# Altium schematic sheet User_Terminal_Block.SchDoc
size A4; SheetNumber: 3; SheetTotal: 4
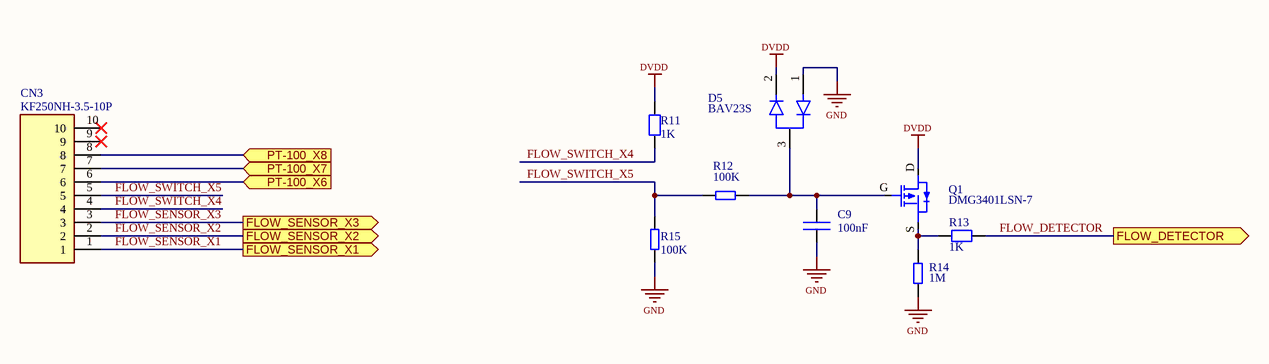
[diagram p0: User_Terminal_Block.SchDoc]

## Parts
C9  100nF  [CAP_SM0603_YAGEOCC2_N]
CN3  KF250NH-3.5-10P  [KF250NH-3.5-10P]
D5  BAV23S  [BAV23S]
Q1  DMG3401LSN-7  [DMG3401LSN-7]
R11  1K  [RES_SM0603_YAGEORC_N]
R12  100K  [RES_SM0603_YAGEORC_N]
R13  1K  [RES_SM0603_YAGEORC_N]
R14  1M  [RES_SM0603_YAGEORC_N]
R15  100K  [RES_SM0603_YAGEORC_N]

## Ports
FLOW_DETECTOR (out), FLOW_SENSOR_X1 (out), FLOW_SENSOR_X2 (out), FLOW_SENSOR_X3 (out), PT-100_X6 (in), PT-100_X7 (in), PT-100_X8 (in)

## Nets
DVDD: D5.2 Q1.D R11.2
GND: C9.2 D5.1 R14.1 R15.1
FLOW_DETECTOR: R13.2 ; port FLOW_DETECTOR
FLOW_SENSOR_X1: CN3.1 ; port FLOW_SENSOR_X1
FLOW_SENSOR_X2: CN3.2 ; port FLOW_SENSOR_X2
FLOW_SENSOR_X3: CN3.3 ; port FLOW_SENSOR_X3
FLOW_SWITCH_X4: CN3.4 R11.1
FLOW_SWITCH_X5: CN3.5 R12.1 R15.2
PT-100_X6: CN3.6 ; port PT-100_X6
PT-100_X7: CN3.7 ; port PT-100_X7
PT-100_X8: CN3.8 ; port PT-100_X8
NetC9_1: C9.1 D5.3 Q1.G R12.2
NetQ1_S: Q1.S R13.1 R14.2

Not connected (* = marked no-connect by the designer): CN3 9* 10*

## Library data of the parts
C9 = CC0603KRX7R9BB104: CAP 100nF SM0603 X7R 50V YAGEO CC2; Tolerance (%): 10; Voltage Rating (Volts): 50; Category: Capacitor; Manufacturer: Yageo; Manufacturer Part Number: CC0603KRX7R9BB104; Package: 0603; Value: 100nF; Supplier Part Number 1: 1362556; Supplier 1: Farnell; ComponentLink1URL: http://www.yageo.com; ComponentLink1Description: Manufacturer Website; Supplier 2: Digi-Key; Supplier Part Number 2: 311-1344-1-ND; Datasheet: https://datasheet.lcsc.com/lcsc/2211101700_YAGEO-CC0603KRX7R9BB104_C14663.pdf
CN3 = KF250NH-3.5-10P: PCB Terminal Block 1752188; Manufacturer: cixi_kefa_elec; Vendor Part Number: C976564; Vendor: LCSC; Manufacturer Part Number: KF250NH-3.5-10P; Price: 1.22
D5 = BAV23S: DIODE ARRAY GP 250V 200MA SOT23; Manufacturer: onsemi; Manufacturer Part Number: BAV23S; Category: Diodo; Datasheet: https://www.onsemi.com/pdf/datasheet/bav23s-d.pdf; Temperature Max: 150; Temperature Min: -55
Q1 = DMG3401LSN-7: P-CHANNEL ENHANCEMENT MODE MOSFET / RDS(ON) = 85mΩ @ VGS = -2.5V -> ID -2.7A / V(BR)DDS 30V; Manufacturer: Diodes Incorporated; Category: Transistor mosfet; Manufacturer Part Number: DMG3401LSN-7; Datasheet: https://www.diodes.com/assets/Datasheets/DMG3401LSN.pdf; Temperature Max: 150; Temperature Min: -55
R11 R13 = RC0603FR-071KL: RES 1K SM0603 YAGEO RC_L; Power (Watts): 0.1; Resistance (Ohms): 1000; Tolerance (%): 1; Category: Resistor; Manufacturer: Yageo; Manufacturer Part Number: RC0603FR-071KL; Package: 0603; Value: 1K; Supplier Part Number 1: 9238484; Supplier 1: Farnell; ComponentLink1Description: Manufacturer Website; ComponentLink1URL: http://www.yageo.com; Supplier 2: Digi-Key; Supplier Part Number 2: 311-1.00KHRCT-ND
R12 R15 = RC0603FR-13100KL: RES 100K SM0603 YAGEO RC_L; Power (Watts): 0.1; Resistance (Ohms): 100000; Tolerance (%): 1; Category: Resistor; Manufacturer: Yageo; Manufacturer Part Number: RC0603FR-13100KL; Package: 0603; Value: 100K; Supplier Part Number 1: 2309107; Supplier 1: Farnell; ComponentLink1Description: Manufacturer Website; ComponentLink1URL: http://www.yageo.com; Supplier 2: Digi-Key
R14 = RC0603FR-071ML: RES 1M SM0603 YAGEO RC_L; Power (Watts): 0.1; Resistance (Ohms): 1000000; Tolerance (%): 1; Category: Resistor; Manufacturer: Yageo; Manufacturer Part Number: RC0603FR-071ML; Package: 0603; Value: 1M; Supplier Part Number 1: 9238840; Supplier 1: Farnell; ComponentLink1URL: http://www.yageo.com; ComponentLink1Description: Manufacturer Website; Supplier 2: Digi-Key; Supplier Part Number 2: 311-1.00MHRCT-ND; Datasheet: https://www.yageo.com/upload/media/product/productsearch/datasheet/rchip/PYu-RC_Group_51_RoHS_L_12.pdf